# EAGLE design node_shield (EAGLE 7.3.0)
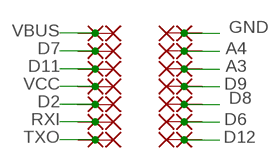
[diagram p0: schematic, sheet 1]

## Parts
PAD1  SMD2  [SMD1,27-2,54]
PAD2  SMD2  [SMD1,27-2,54]
PAD3  SMD2  [SMD1,27-2,54]
PAD4  SMD2  [SMD1,27-2,54]
PAD5  SMD2  [SMD1,27-2,54]
PAD6  SMD2  [SMD1,27-2,54]
PAD7  SMD2  [SMD1,27-2,54]
PAD8  SMD2  [SMD1,27-2,54]
PAD9  SMD2  [SMD1,27-2,54]
PAD10  SMD2  [SMD1,27-2,54]
PAD11  SMD2  [SMD1,27-2,54]
PAD12  SMD2  [SMD1,27-2,54]
PAD13  SMD2  [SMD1,27-2,54]
PAD14  SMD2  [SMD1,27-2,54]
PAD15  SMD2  [SMD1,27-2,54]
PAD16  SMD2  [SMD1,27-2,54]
PAD17  SMD2  [SMD1,27-2,54]
PAD18  SMD2  [SMD1,27-2,54]
PAD19  SMD2  [SMD1,27-2,54]
PAD20  SMD2  [SMD1,27-2,54]
PAD21  SMD2  [SMD1,27-2,54]
PAD22  SMD2  [SMD1,27-2,54]
PAD23  SMD2  [SMD1,27-2,54]
PAD24  SMD2  [SMD1,27-2,54]
PAD25  SMD2  [SMD1,27-2,54]
PAD26  SMD2  [SMD1,27-2,54]
PAD27  SMD2  [SMD1,27-2,54]
PAD28  SMD2  [SMD1,27-2,54]

## Nets
A3: PAD6.1(P) PAD24.1(P)
A4: PAD5.1(P) PAD23.1(P)
D2: PAD12.1(P) PAD19.1(P)
D6: PAD4.1(P) PAD27.1(P)
D7: PAD2.1(P) PAD16.1(P)
D8: PAD11.1(P) PAD26.1(P)
D9: PAD1.1(P) PAD25.1(P)
D11: PAD7.1(P) PAD17.1(P)
D12: PAD3.1(P) PAD28.1(P)
GND: PAD8.1(P) PAD22.1(P)
RXI: PAD14.1(P) PAD20.1(P)
TXO: PAD13.1(P) PAD21.1(P)
VBUS [power]: PAD9.1(P) PAD15.1(P)
VCC [power]: PAD10.1(P) PAD18.1(P)

## Library data of the parts
PAD1-PAD28 = wirepad:SMD2: SMD PAD

## Net classes
1 power: width 0.254 mm, clearance 0.203 mm

## Board
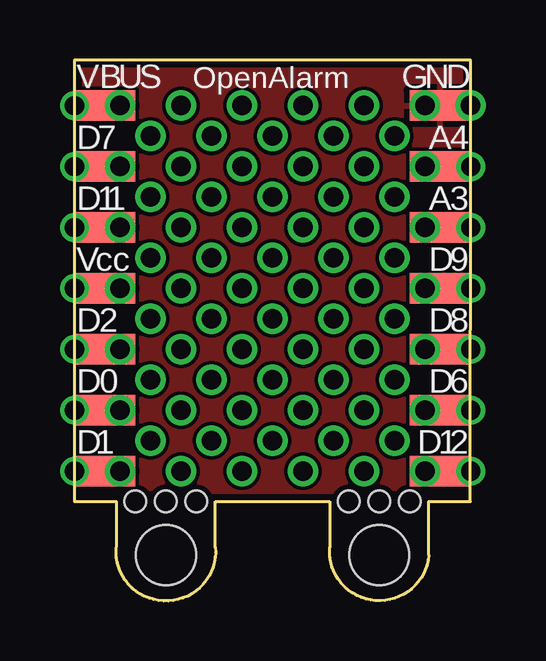
[diagram p1: board, top side]
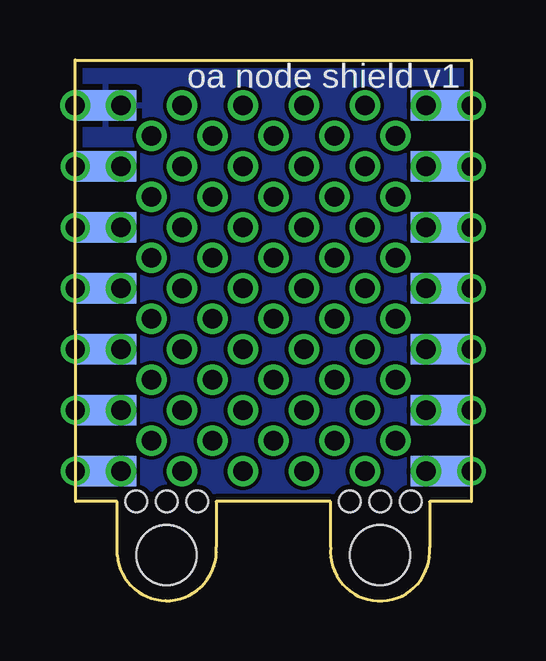
[diagram p2: board, bottom side, seen from below]

Size 16.51 x 22.56 mm. Coordinates in mm from the lower left corner, seen from the top.
Outline: 16.51,22.56 16.51,18.43 16.5,4.15 14.76,4.15 14.76,1.92 arc-180 10.64,2.24 10.64,4.15 5.87,4.15 5.87,2.24 arc-190 1.75,2.24 1.75,4.15 0,4.15 0,22.55
Outline: 16.5,22.56 0,22.56
Copper layers (1*16): Top 0.035mm / dielectric 1.5mm / Bottom 0.035mm
Design rules "SeeedStudio_2layer_DRU_no_angle_20140221": minimum track width 6mil, minimum drill 12mil, track to track 6mil, track to pad 6mil, pad to pad 6mil, via to via 6mil, smd to smd 0mil, copper to edge 10mil, drill to drill 10mil, minimum pad ring 10mil, minimum via ring 6mil, stop-mask expansion 2mil, vias tented up to drill 100mil, thermal gap 10mil
Holes 2.5 mm at 3.81,1.92 12.7,1.92
Holes 0.9 mm at 2.54,4.15 3.81,4.15 5.08,4.15 11.43,4.15 12.7,4.15 13.97,4.15

### Footprints (pad centres in the part's own frame; a part is rotated, then mirrored left to right if it is on the bottom)
SMD1,27-2,54 = smd 1.27 x 2.54: 1 0,0

### Placement (x,y rotation side)
PAD1  15.24,13.04 90 top
PAD2  1.27,18.12 90 top
PAD3  15.24,5.42 90 top
PAD4  15.24,7.96 90 top
PAD5  15.24,18.12 90 top
PAD6  15.24,15.58 90 top
PAD7  1.27,15.58 90 top
PAD8  15.24,20.66 90 top
PAD9  1.27,20.66 90 bottom
PAD10  1.27,13.04 90 top
PAD11  15.24,10.5 90 top
PAD12  1.27,10.5 90 top
PAD13  1.27,5.42 90 top
PAD14  1.27,7.96 90 top
PAD15  1.27,20.66 90 top
PAD16  1.27,18.12 90 bottom
PAD17  1.27,15.58 90 bottom
PAD18  1.27,13.04 90 bottom
PAD19  1.27,10.5 90 bottom
PAD20  1.27,7.96 90 bottom
PAD21  1.27,5.42 90 bottom
PAD22  15.24,20.66 270 bottom
PAD23  15.24,18.12 270 bottom
PAD24  15.24,15.58 270 bottom
PAD25  15.24,13.04 270 bottom
PAD26  15.24,10.5 270 bottom
PAD27  15.24,7.96 270 bottom
PAD28  15.24,5.42 270 bottom

### Tracks (layer width: path | path; a pad name or v marks a point on that pad's centre or on a via)
A3  (1 unrouted)
A4  (via drill 0.81 pad 1.27)  (1 unrouted)
  Top 0.203: v14.61,18.12 PAD23.1
D2  (via drill 0.81 pad 1.27)  (1 unrouted)
  Top 0.203: PAD19.1 v1.91,10.5 2.22,10.5
D6  (1 unrouted)
D7  (1 unrouted)
  Top 0.203: PAD16.1 1.75,18.12
D8  (1 unrouted)
D9  (1 unrouted)
D11  (1 unrouted)
D12  (1 unrouted)
GND  (via drill 0.81 pad 1.27)
  other vias: 14.61,20.66 16.51,20.66
  pour Bottom: 0,4.15 16.51,4.15 16.51,22.56 0,22.56
  pour Top: 0,22.56 0,4.15 16.51,4.15 16.51,22.56
N$1  (via drill 0.81 pad 1.27)
  other vias: 6.99,20.66
N$2  (via drill 0.81 pad 1.27)
  other vias: 4.45,5.42
N$3  (via drill 0.81 pad 1.27)
  other vias: 9.53,20.66
N$4  (via drill 0.81 pad 1.27)
  other vias: 8.26,9.23
N$5  (via drill 0.81 pad 1.27)
  other vias: 6.99,18.12
N$6  (via drill 0.81 pad 1.27)
  other vias: 8.26,11.77
N$7  (via drill 0.81 pad 1.27)
  other vias: 9.53,18.12
N$8  (via drill 0.81 pad 1.27)
  other vias: 8.26,14.31
N$9  (via drill 0.81 pad 1.27)
  other vias: 6.99,15.58
N$10  (via drill 0.81 pad 1.27)
  other vias: 8.26,16.85
N$11  (via drill 0.81 pad 1.27)
  other vias: 9.53,15.58
N$12  (via drill 0.8)
  other vias: 0,20.66
N$13  (via drill 0.81 pad 1.27)
  other vias: 10.79,19.39
N$14  (via drill 0.8)
  other vias: 0,18.12
N$15  (via drill 0.8)
  other vias: 0,15.58
N$16  (via drill 0.8)
  other vias: 0,13.04
N$17  (via drill 0.8)
  other vias: 0,10.5
N$18  (via drill 0.8)
  other vias: 0,7.96
N$19  (via drill 0.8)
  other vias: 0,5.42
N$20  (via drill 0.81 pad 1.27)
  other vias: 3.17,14.31
N$21  (via drill 0.8)
  other vias: 16.51,18.12
N$22  (via drill 0.8)
  other vias: 16.51,15.58
N$23  (via drill 0.8)
  other vias: 16.51,13.04
N$24  (via drill 0.8)
  other vias: 16.51,10.5
N$25  (via drill 0.8)
  other vias: 16.51,7.96
N$26  (via drill 0.8)
  other vias: 16.51,5.42
N$27  (via drill 0.81 pad 1.27)
  other vias: 6.99,13.04
N$28  (via drill 0.81 pad 1.27)
  other vias: 4.45,15.58
N$29  (via drill 0.81 pad 1.27)
  other vias: 9.53,13.04
N$30  (via drill 0.81 pad 1.27)
  other vias: 3.17,16.85
N$31  (via drill 0.81 pad 1.27)
  other vias: 6.99,10.5
N$32  (via drill 0.81 pad 1.27)
  other vias: 4.45,18.12
N$33  (via drill 0.81 pad 1.27)
  other vias: 9.53,10.5
N$34  (via drill 0.81 pad 1.27)
  other vias: 5.71,19.39
N$35  (via drill 0.81 pad 1.27)
  other vias: 3.17,19.39
N$36  (via drill 0.81 pad 1.27)
  other vias: 9.53,7.96
N$37  (via drill 0.81 pad 1.27)
  other vias: 8.26,6.69
N$38  (via drill 0.81 pad 1.27)
  other vias: 6.99,7.96
N$39  (via drill 0.81 pad 1.27)
  other vias: 6.99,5.42
N$40  (via drill 0.81 pad 1.27)
  other vias: 4.45,20.66
N$41  (via drill 0.81 pad 1.27)
  other vias: 9.53,5.42
N$42  (via drill 0.81 pad 1.27)
  other vias: 10.79,6.69
N$43  (via drill 0.81 pad 1.27)
  other vias: 1.91,20.66
N$44  (via drill 0.81 pad 1.27)
  other vias: 1.91,18.12
N$45  (via drill 0.81 pad 1.27)
  other vias: 1.91,15.58
N$46  (via drill 0.81 pad 1.27)
  other vias: 1.91,13.04
N$47  (via drill 0.81 pad 1.27)
  other vias: 1.91,5.42
N$48  (via drill 0.81 pad 1.27)
  other vias: 14.61,5.42
N$49  (via drill 0.81 pad 1.27)
  other vias: 14.61,7.96
N$50  (via drill 0.81 pad 1.27)
  other vias: 14.61,10.5
N$51  (via drill 0.81 pad 1.27)
  other vias: 14.61,13.04
N$52  (via drill 0.81 pad 1.27)
  other vias: 14.61,15.58
N$53  (via drill 0.81 pad 1.27)
  other vias: 12.06,20.66
N$54  (via drill 0.81 pad 1.27)
  other vias: 5.71,16.85
N$55  (via drill 0.81 pad 1.27)
  other vias: 13.34,19.39
N$56  (via drill 0.81 pad 1.27)
  other vias: 12.06,18.12
N$57  (via drill 0.81 pad 1.27)
  other vias: 5.71,11.77
N$58  (via drill 0.81 pad 1.27)
  other vias: 13.34,16.85
N$59  (via drill 0.81 pad 1.27)
  other vias: 5.71,9.23
N$60  (via drill 0.81 pad 1.27)
  other vias: 12.06,15.58
N$61  (via drill 0.81 pad 1.27)
  other vias: 10.79,16.85
N$62  (via drill 0.81 pad 1.27)
  other vias: 5.71,14.31
N$63  (via drill 0.81 pad 1.27)
  other vias: 13.34,14.31
N$64  (via drill 0.81 pad 1.27)
  other vias: 5.71,6.69
N$65  (via drill 0.81 pad 1.27)
  other vias: 10.79,14.31
N$66  (via drill 0.81 pad 1.27)
  other vias: 12.06,13.04
N$67  (via drill 0.81 pad 1.27)
  other vias: 10.79,11.77
N$68  (via drill 0.81 pad 1.27)
  other vias: 13.34,11.77
N$69  (via drill 0.81 pad 1.27)
  other vias: 10.79,9.23
N$70  (via drill 0.81 pad 1.27)
  other vias: 12.06,10.5
N$71  (via drill 0.81 pad 1.27)
  other vias: 13.34,9.23
N$72  (via drill 0.81 pad 1.27)
  other vias: 12.06,7.96
N$73  (via drill 0.81 pad 1.27)
  other vias: 13.34,6.69
N$74  (via drill 0.81 pad 1.27)
  other vias: 12.06,5.42
N$75  (via drill 0.81 pad 1.27)
  other vias: 4.45,13.04
N$76  (via drill 0.81 pad 1.27)
  other vias: 3.17,11.77
N$77  (via drill 0.81 pad 1.27)
  other vias: 4.45,10.5
N$78  (via drill 0.81 pad 1.27)
  other vias: 3.17,9.23
N$79  (via drill 0.81 pad 1.27)
  other vias: 4.45,7.96
N$80  (via drill 0.81 pad 1.27)
  other vias: 3.17,6.69
N$81  (via drill 0.81 pad 1.27)
  other vias: 8.26,19.39
RXI  (via drill 0.81 pad 1.27)  (1 unrouted)
  Top 0.203: 2.22,7.96 v1.91,7.96 PAD20.1
TXO  (1 unrouted)
VBUS  (1 unrouted)
  Top 0.203: 0.79,20.66 PAD9.1
VCC  (1 unrouted)

### Text on the board
tNames: V | B | U | S | OpenAlarm | G | N | D | D | 7 | A | 4 | D | 1 | 1 | A | 3 | V | c | c | D | 9 | D | 2 | D | 8 | D | 0 | D | 6 | D | 1 | D | 1 | 2
bNames: oa node shield v1